# Altium schematic sheet NEpic.SchDoc
size A
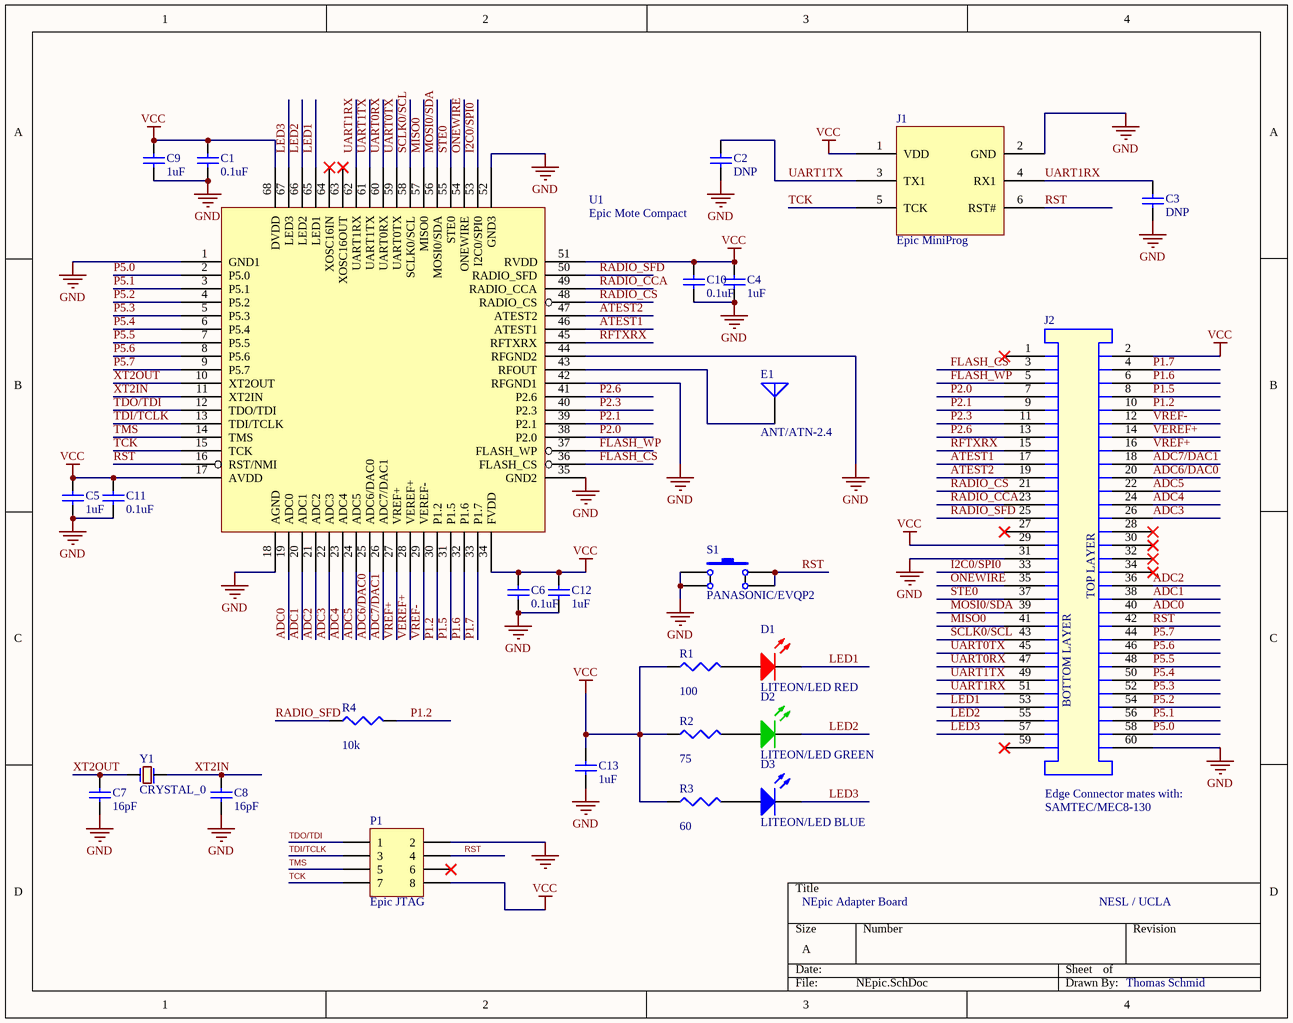
[diagram p0: NEpic.SchDoc]

## Parts
C1  value 0.1uF  [CC1608-0603]  (hidden comment: Cap)
C2  value DNP  [CC1608-0603]  (hidden comment: Cap)
C3  value DNP  [CC1608-0603]  (hidden comment: Cap)
C4  value 1uF  [CC1608-0603]  (hidden comment: Cap)
C5  value 1uF  [CC1608-0603]  (hidden comment: Cap)
C6  value 0.1uF  [CC1608-0603]  (hidden comment: Cap)
C7  value 16pF  [CC1608-0603]  (hidden comment: Cap)
C8  value 16pF  [CC1608-0603]  (hidden comment: Cap)
C9  value 1uF  [CC1608-0603]  (hidden comment: Cap)
C10  value 0.1uF  [CC1608-0603]  (hidden comment: Cap)
C11  value 0.1uF  [CC1608-0603]  (hidden comment: Cap)
C12  value 1uF  [CC1608-0603]  (hidden comment: Cap)
C13  value 1uF  [CC1608-0603]  (hidden comment: Cap)
D1  LITEON/LED RED  [LITEON/LED/0603]
D2  LITEON/LED GREEN  [LITEON/LED/0603]
D3  LITEON/LED BLUE  [LITEON/LED/0603]
E1  ANT/ATN-2.4  [ANT/ANT-2.45-CHPCT-ND]
J1  Epic MiniProg  [6-pin 2mm]
J2  SAMTEC/MEC8-130  [SAMTEC/MEC8L-130-CARD]
P1  Epic JTAG  [Thomas/Header 2x4 2mm]
R1  value 100  [CR1608-0603]  (hidden comment: Res3)
R2  value 75  [CR1608-0603]  (hidden comment: Res3)
R3  value 60  [CR1608-0603]  (hidden comment: Res3)
R4  value 10k  [CR1608-0603]  (hidden comment: Res3)
S1  PANASONIC/EVQP2  [PANASONIC/EVQP2]
U1  Epic Mote Compact  [EPIC-Footprint]
Y1  CRYSTAL_0  [FOX/FQ7050B]

## Nets
GND: C1.1 C2.1 C3.1 C4.1 C5.1 C6.1 C7.1 C8.1 C9.1 C10.1 C11.1 C12.1 C13.1 J1.2(GND) J2.31 J2.60 P1.2 S1.1 S1.3 U1.1(GND1) U1.18(AGND) U1.35(GND2) U1.42(RFGND1) U1.44(RFGND2) U1.52(GND3)
VCC: C1.2 C4.2 C5.2 C6.2 C9.2 C10.2 C11.2 C12.2 C13.2 J1.1(VDD) J2.2 J2.29 P1.8 R1.1 R2.1 R3.1 U1.17(AVDD) U1.34(FVDD) U1.51(RVDD) U1.68(DVDD)
ADC0: J2.40 U1.19(ADC0)
ADC1: J2.38 U1.20(ADC1)
ADC2: J2.36 U1.21(ADC2)
ADC3: J2.26 U1.22(ADC3)
ADC4: J2.24 U1.23(ADC4)
ADC5: J2.22 U1.24(ADC5)
ADC6/DAC0: J2.20 U1.25(ADC6/DAC0)
ADC7/DAC1: J2.18 U1.26(ADC7/DAC1)
ATEST1: J2.17 U1.46(ATEST1)
ATEST2: J2.19 U1.47(ATEST2)
FLASH_CS: J2.3 U1.36(FLASH_CS)
FLASH_WP: J2.5 U1.37(FLASH_WP)
I2C0/SPI0: J2.33 U1.53(I2C0/SPI0)
LED1: D1.2(K) J2.53 U1.65(LED1)
LED2: D2.2(K) J2.55 U1.66(LED2)
LED3: D3.2(K) J2.57 U1.67(LED3)
MISO0: J2.41 U1.57(MISO0)
MOSI0/SDA: J2.39 U1.56(MOSI0/SDA)
ONEWIRE: J2.35 U1.54(ONEWIRE)
P1.2: J2.10 R4.2 U1.30(P1.2)
P1.5: J2.8 U1.31(P1.5)
P1.6: J2.6 U1.32(P1.6)
P1.7: J2.4 U1.33(P1.7)
P2.0: J2.7 U1.38(P2.0)
P2.1: J2.9 U1.39(P2.1)
P2.3: J2.11 U1.40(P2.3)
P2.6: J2.13 U1.41(P2.6)
P5.0: J2.58 U1.2(P5.0)
P5.1: J2.56 U1.3(P5.1)
P5.2: J2.54 U1.4(P5.2)
P5.3: J2.52 U1.5(P5.3)
P5.4: J2.50 U1.6(P5.4)
P5.5: J2.48 U1.7(P5.5)
P5.6: J2.46 U1.8(P5.6)
P5.7: J2.44 U1.9(P5.7)
RADIO_CCA: J2.23 U1.49(RADIO_CCA)
RADIO_CS: J2.21 U1.48(RADIO_CS)
RADIO_SFD: J2.25 R4.1 U1.50(RADIO_SFD)
RFTXRX: J2.15 U1.45(RFTXRX)
RST: J1.6(RST#) J2.42 P1.4 S1.2 S1.4 U1.16(RST/NMI)
SCLK0/SCL: J2.43 U1.58(SCLK0/SCL)
STE0: J2.37 U1.55(STE0)
TCK: J1.5(TCK) P1.7 U1.15(TCK)
TDI/TCLK: P1.3 U1.13(TDI/TCLK)
TDO/TDI: P1.1 U1.12(TDO/TDI)
TMS: P1.5 U1.14(TMS)
UART0RX: J2.47 U1.60(UART0RX)
UART0TX: J2.45 U1.59(UART0TX)
UART1RX: C3.2 J1.4(RX1) J2.51 U1.62(UART1RX)
UART1TX: C2.2 J1.3(TX1) J2.49 U1.61(UART1TX)
VEREF+: J2.14 U1.28(VEREF+)
VREF+: J2.16 U1.27(VREF+)
VREF-: J2.12 U1.29(VEREF-)
XT2IN: C8.2 U1.11(XT2IN) Y1.2
XT2OUT: C7.2 U1.10(XT2OUT) Y1.1
NetD1_1: D1.1(A) R1.2
NetD2_1: D2.1(A) R2.2
NetD3_1: D3.1(A) R3.2
NetE1_1: E1.1(A) U1.43(RFOUT)

Not connected (* = marked no-connect by the designer): J2 1* 27* 28* 30* 32* 34* 59*; P1 6*; U1 63(XOSC16OUT)* 64(XOSC16IN)*

## Notes on the sheet
- (near J2) Edge Connector mates with:
- NEpic Adapter Board
- NESL / UCLA
- Thomas Schmid
- (in symbol SAMTEC/HSEC8/50) TOP LAYER; BOTTOM LAYER

## Library data of the parts
C1-C13 = Cap: Capacitor (Semiconductor SIM Model); Published: 8-Jun-2000; LatestRevisionDate: 29-May-2009; LatestRevisionNote: IPC-7351 Footprint Added.; PackageReference: C1206; Publisher: Altium Limited; PackageDescription: Chip Capacitor
D1 = LITEON/LED RED: LiteOn Red LED 0605 Footprint; Published: 8-Jun-2000; LatestRevisionDate: 17-Jul-2002; LatestRevisionNote: Re-released for DXP Platform.; PackageVersion: Feb-2002; PackageReference: 3.2X1.6X1.1; Publisher: Altium Limited
D2 = LITEON/LED GREEN: LiteOn Green LED 0605 Footprint; Published: 8-Jun-2000; LatestRevisionDate: 17-Jul-2002; LatestRevisionNote: Re-released for DXP Platform.; PackageVersion: Feb-2002; PackageReference: 3.2X1.6X1.1; Publisher: Altium Limited
D3 = LITEON/LED BLUE: LiteOn Blue LED 0605 Footprint; Published: 8-Jun-2000; LatestRevisionDate: 17-Jul-2002; LatestRevisionNote: Re-released for DXP Platform.; PackageVersion: Feb-2002; PackageReference: 3.2X1.6X1.1; Publisher: Altium Limited
E1 = Antenna: ANT/ANT-2.4 Chip Antenna; Published: 24-Mar-1999; LatestRevisionDate: 17-Jul-2002; LatestRevisionNote: Re-released for DXP Platform.; PackageReference: PIN1; Publisher: Altium Limited
J2 = SAMTEC/HSEC8/50: 0.8mm Pitch 60 pin Card Edge Socket; mfrName: Samtec; Value: MEC8-130; URL_Datasheet: http://www.samtec.com/signal_integrity/technical_specifications/overview.asp?series=MEC8&menu=Signal_Integrity; Date_Created: 8/21/2009 1:12:42 AM; Verified: False; Type: Card Edge/Edgeboard Connectors
P1 = Header 4X2: Header, 4-Pin, Dual row; LatestRevisionDate: 17-Jul-2002; LatestRevisionNote: Re-released for DXP Platform.; Publisher: Altium Limited
R1-R4 = Res3: Resistor; Published: 8-Jun-2000; LatestRevisionDate: 29-May-2009; LatestRevisionNote: IPC-7351 Footprint Added.; PackageReference: J1-0603; Publisher: Altium Limited; PackageDescription: Chip Resistor
S1 = PANASONIC/EVQP2: Published: 24-Mar-1999; LatestRevisionDate: 17-Jul-2002; LatestRevisionNote: Re-released for DXP Platform.; PackageReference: SPST-2; Publisher: Altium Limited